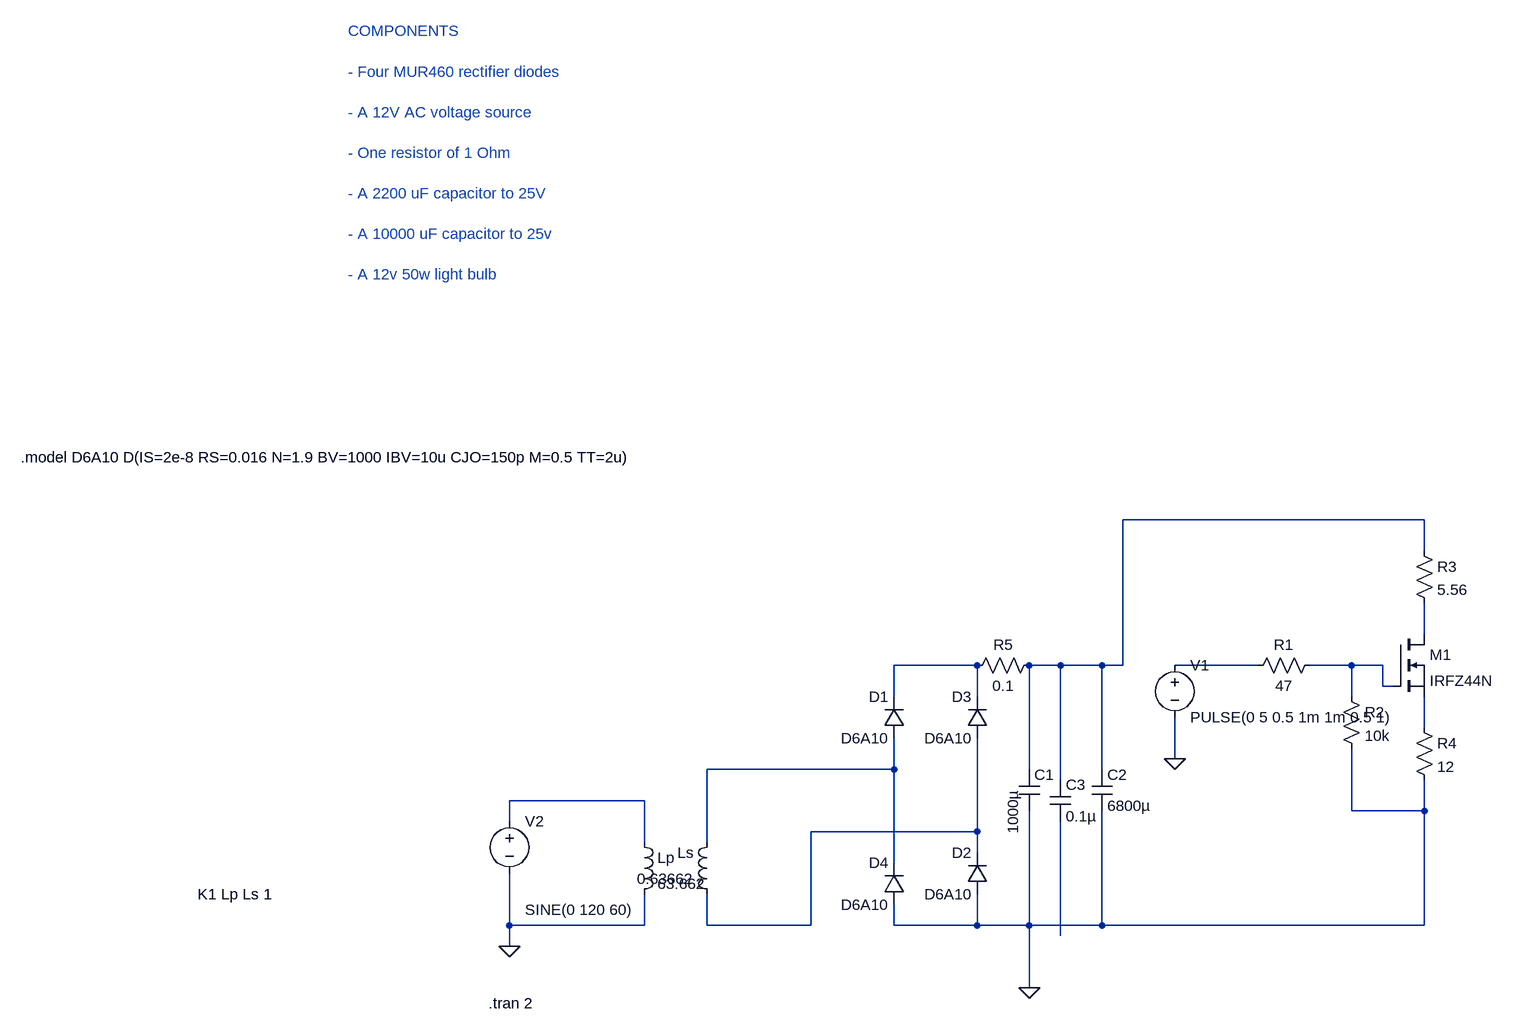
[diagram p0: schematic mosfet.asc]
mosfet.asc, the LTspice schematic file:
Version 4.1
SHEET 1 2020 680
WIRE 544 -432 80 -432
WIRE 544 -384 544 -432
WIRE 544 -256 544 -304
WIRE -144 -208 -272 -208
WIRE -16 -208 -64 -208
WIRE 48 -208 -16 -208
WIRE 80 -208 80 -432
WIRE 80 -208 48 -208
WIRE 288 -208 160 -208
WIRE 432 -208 368 -208
WIRE 480 -208 432 -208
WIRE 480 -176 480 -208
WIRE 496 -176 480 -176
WIRE -272 -160 -272 -208
WIRE -144 -160 -144 -208
WIRE 432 -160 432 -208
WIRE 544 -112 544 -160
WIRE 160 -64 160 -128
WIRE -272 -48 -272 -96
WIRE -272 -48 -560 -48
WIRE -64 -48 -64 -208
WIRE 48 -48 48 -208
WIRE -16 -32 -16 -208
WIRE -656 0 -864 0
WIRE 432 16 432 -80
WIRE 544 16 544 -32
WIRE 544 16 432 16
WIRE -864 32 -864 0
WIRE -144 48 -144 -96
WIRE -144 48 -400 48
WIRE -656 64 -656 0
WIRE -560 64 -560 -48
WIRE -144 80 -144 48
WIRE -272 96 -272 -48
WIRE -864 192 -864 112
WIRE -656 192 -656 144
WIRE -656 192 -864 192
WIRE -560 192 -560 144
WIRE -400 192 -400 48
WIRE -400 192 -560 192
WIRE -272 192 -272 160
WIRE -144 192 -144 144
WIRE -144 192 -272 192
WIRE -64 192 -64 16
WIRE -64 192 -144 192
WIRE 48 192 48 16
WIRE 48 192 -64 192
WIRE 544 192 544 16
WIRE 544 192 48 192
WIRE -16 208 -16 32
WIRE -864 224 -864 192
WIRE -64 288 -64 192
FLAG -64 288 0
FLAG -864 224 0
FLAG 160 -64 0
SYMBOL diode -256 -96 R180
WINDOW 0 24 64 Left 2
WINDOW 3 24 0 Left 2
SYMATTR InstName D1
SYMATTR Value D6A10
SYMBOL diode -128 144 R180
WINDOW 0 24 64 Left 2
WINDOW 3 24 0 Left 2
SYMATTR InstName D2
SYMATTR Value D6A10
SYMBOL diode -128 -96 R180
WINDOW 0 24 64 Left 2
WINDOW 3 24 0 Left 2
SYMATTR InstName D3
SYMATTR Value D6A10
SYMBOL diode -256 160 R180
WINDOW 0 24 64 Left 2
WINDOW 3 24 0 Left 2
SYMATTR InstName D4
SYMATTR Value D6A10
SYMBOL cap -80 -48 R0
WINDOW 3 -9 100 VLeft 2
SYMATTR Value 1000µ
SYMATTR InstName C1
SYMATTR SpiceLine V=50 Irms=1.2 Rser=0.044 Lser=13.616n
SYMBOL voltage -864 16 R0
WINDOW 3 24 152 Left 2
WINDOW 123 24 124 Left 2
WINDOW 39 0 0 Left 0
SYMATTR Value SINE(0 120 60)
SYMATTR InstName V2
SYMBOL ind -672 48 R0
SYMATTR InstName Lp
SYMATTR Value 63.662
SYMATTR Type ind
SYMATTR SpiceLine Rser=0.01
SYMBOL ind -544 160 R180
WINDOW 0 36 80 Left 2
WINDOW 3 36 40 Left 2
SYMATTR InstName Ls
SYMATTR Value 0.63662
SYMATTR Type ind
SYMBOL res 384 -224 R90
WINDOW 0 0 56 VBottom 2
WINDOW 3 32 56 VTop 2
SYMATTR InstName R1
SYMATTR Value 47
SYMATTR SpiceLine tol=5 pwr=2
SYMBOL res 416 -176 R0
SYMATTR InstName R2
SYMATTR Value 10k
SYMATTR SpiceLine tol=5 pwr=1/4
SYMBOL res 528 -400 R0
SYMATTR InstName R3
SYMATTR Value 5.56
SYMATTR SpiceLine tol=5 pwr=25
SYMBOL voltage 160 -224 R0
WINDOW 123 0 0 Left 0
WINDOW 39 0 0 Left 0
SYMATTR InstName V1
SYMATTR Value PULSE(0 5 0.5 1m 1m 0.5 1)
SYMBOL res 528 -128 R0
SYMATTR InstName R4
SYMATTR Value 12
SYMATTR SpiceLine tol=5 pwr=5
SYMBOL nmos 496 -256 R0
SYMATTR InstName M1
SYMATTR Value IRFZ44N
SYMBOL res -48 -224 R90
WINDOW 0 0 56 VBottom 2
WINDOW 3 32 56 VTop 2
SYMATTR InstName R5
SYMATTR Value 0.1
SYMBOL cap 32 -48 R0
SYMATTR InstName C2
SYMATTR Value 6800µ
SYMATTR SpiceLine V=50
SYMBOL cap -32 -32 R0
SYMATTR InstName C3
SYMATTR Value 0.1µ
SYMATTR SpiceLine V=50 Irms=0 Rser=0.105 Lser=784p mfg="Würth Elektronik" pn="885382206004 WCAP-CSST 0603" type="X7R"
TEXT -1112 -1184 Left 2 ;COMPONENTS\n \n- Four MUR460 rectifier diodes\n \n- A 12V AC voltage source\n \n- One resistor of 1 Ohm\n \n- A 2200 uF capacitor to 25V\n \n- A 10000 uF capacitor to 25v\n \n- A 12v 50w light bulb
TEXT -1616 -528 Left 2 !.model D6A10 D(IS=2e-8 RS=0.016 N=1.9 BV=1000 IBV=10u CJO=150p M=0.5 TT=2u)
TEXT -896 312 Left 2 !.tran 2
TEXT -1344 144 Left 2 !K1 Lp Ls 1

The netlist it stands for:
* mosfet.asc
D1 N007 N003 D6A10
D2 0 N009 D6A10
D3 N009 N003 D6A10
D4 0 N007 D6A10
C1 N001 0 1000µ V=50 Irms=1.2 Rser=0.044 Lser=13.616n
V2 N008 0 SINE(0 120 60)
Lp N008 0 63.662 Rser=0.01
Ls N009 N007 0.63662
R1 N005 N004 47 tol=5 pwr=2
R2 N005 0 10k tol=5 pwr=1/4
R3 N001 N002 5.56 tol=5 pwr=25
V1 N004 0 PULSE(0 5 0.5 1m 1m 0.5 1)
R4 N006 0 12 tol=5 pwr=5
M1 N002 N005 N006 N006 IRFZ44N
R5 N001 N003 0.1
C2 N001 0 6800µ V=50
C3 N001 N010 0.1µ V=50 Irms=0 Rser=0.105 Lser=784p mfg="Würth Elektronik" pn="885382206004 WCAP-CSST 0603" type="X7R"
.model D D
.lib standard.dio
.model NMOS NMOS
.model PMOS PMOS
.lib standard.mos
* COMPONENTS
* - Four MUR460 rectifier diodes
* - A 12V AC voltage source
* - One resistor of 1 Ohm
* - A 2200 uF capacitor to 25V
* - A 10000 uF capacitor to 25v
* - A 12v 50w light bulb
.model D6A10 D(IS=2e-8 RS=0.016 N=1.9 BV=1000 IBV=10u CJO=150p M=0.5 TT=2u)
.tran 2
K1 Lp Ls 1
.backanno
.end